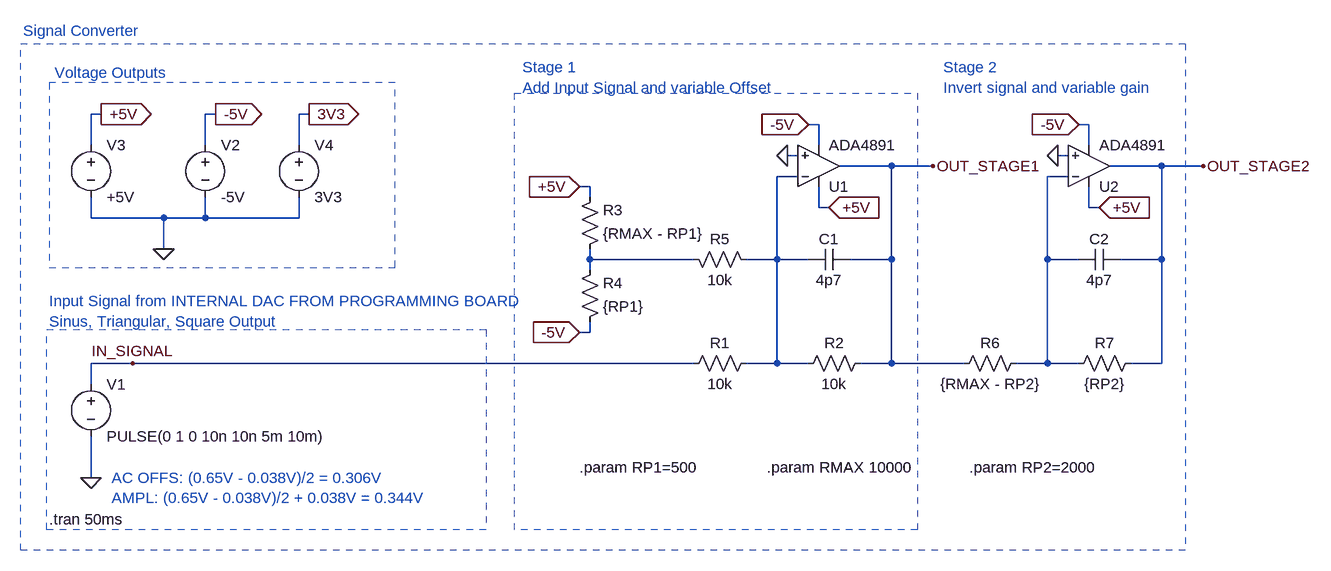
[diagram p0: schematic signal_converter_final2.asc]
signal_converter_final2.asc, the LTspice schematic file:
Version 4
SHEET 1 2372 984
WIRE 32 -320 16 -320
WIRE 208 -320 192 -320
WIRE 352 -320 336 -320
WIRE 1136 -304 1120 -304
WIRE 1552 -304 1536 -304
WIRE 16 -272 16 -320
WIRE 192 -272 192 -320
WIRE 336 -272 336 -320
WIRE 1136 -272 1136 -304
WIRE 1552 -272 1552 -304
WIRE 1104 -256 1088 -256
WIRE 1520 -256 1504 -256
WIRE 1248 -240 1168 -240
WIRE 1312 -240 1248 -240
WIRE 1664 -240 1584 -240
WIRE 1728 -240 1664 -240
WIRE 1104 -224 1072 -224
WIRE 1520 -224 1488 -224
WIRE 784 -208 768 -208
WIRE 784 -192 784 -208
WIRE 1136 -176 1136 -208
WIRE 1152 -176 1136 -176
WIRE 1552 -176 1552 -208
WIRE 1568 -176 1552 -176
WIRE 16 -160 16 -192
WIRE 128 -160 16 -160
WIRE 192 -160 192 -192
WIRE 192 -160 128 -160
WIRE 336 -160 336 -192
WIRE 336 -160 192 -160
WIRE 128 -112 128 -160
WIRE 784 -96 784 -112
WIRE 944 -96 784 -96
WIRE 1072 -96 1072 -224
WIRE 1072 -96 1024 -96
WIRE 1120 -96 1072 -96
WIRE 1248 -96 1248 -240
WIRE 1248 -96 1184 -96
WIRE 1488 -96 1488 -224
WIRE 1536 -96 1488 -96
WIRE 1664 -96 1664 -240
WIRE 1664 -96 1600 -96
WIRE 784 -80 784 -96
WIRE 784 16 784 0
WIRE 784 16 768 16
WIRE 80 64 16 64
WIRE 944 64 80 64
WIRE 1072 64 1072 -96
WIRE 1072 64 1024 64
WIRE 1120 64 1072 64
WIRE 1248 64 1248 -96
WIRE 1248 64 1200 64
WIRE 1360 64 1248 64
WIRE 1488 64 1488 -96
WIRE 1488 64 1440 64
WIRE 1536 64 1488 64
WIRE 1664 64 1664 -96
WIRE 1664 64 1616 64
WIRE 16 96 16 64
WIRE 16 240 16 176
FLAG 16 240 0
FLAG 128 -112 0
FLAG 32 -320 +5V
IOPIN 32 -320 Out
FLAG 208 -320 -5V
IOPIN 208 -320 Out
FLAG 352 -320 3V3
IOPIN 352 -320 Out
FLAG 80 64 IN_SIGNAL
FLAG 1152 -176 +5V
IOPIN 1152 -176 In
FLAG 1120 -304 -5V
IOPIN 1120 -304 In
FLAG 1312 -240 OUT_STAGE1
FLAG 768 -208 +5V
IOPIN 768 -208 In
FLAG 1568 -176 +5V
IOPIN 1568 -176 In
FLAG 1536 -304 -5V
IOPIN 1536 -304 In
FLAG 768 16 -5V
IOPIN 768 16 In
FLAG 1728 -240 OUT_STAGE2
FLAG 1088 -256 0
FLAG 1504 -256 0
SYMBOL voltage 16 80 R0
WINDOW 123 0 0 Left 2
WINDOW 39 0 0 Left 2
SYMATTR InstName V1
SYMATTR Value PULSE(0 1 0 10n 10n 5m 10m)
SYMBOL voltage 192 -288 R0
WINDOW 123 0 0 Left 2
WINDOW 39 0 0 Left 2
SYMATTR InstName V2
SYMATTR Value -5V
SYMBOL voltage 16 -288 R0
WINDOW 123 0 0 Left 2
WINDOW 39 0 0 Left 2
SYMATTR InstName V3
SYMATTR Value +5V
SYMBOL voltage 336 -288 R0
WINDOW 123 0 0 Left 2
WINDOW 39 0 0 Left 2
SYMATTR InstName V4
SYMATTR Value 3V3
SYMBOL res 1520 80 R270
WINDOW 3 0 56 VBottom 2
WINDOW 0 32 56 VTop 2
SYMATTR Value {RP2}
SYMATTR InstName R7
SYMBOL ADA4891 1136 -176 M180
SYMATTR InstName U1
SYMBOL /res 1456 48 R90
WINDOW 0 0 56 VBottom 2
WINDOW 3 32 56 VTop 2
SYMATTR InstName R6
SYMATTR Value {RMAX - RP2}
SYMBOL res 768 -96 M180
WINDOW 0 36 76 Left 2
WINDOW 3 36 40 Left 2
SYMATTR InstName R3
SYMATTR Value {RMAX - RP1}
SYMBOL res 768 16 M180
WINDOW 0 36 76 Left 2
WINDOW 3 36 40 Left 2
SYMATTR InstName R4
SYMATTR Value {RP1}
SYMBOL ADA4891 1552 -176 M180
SYMATTR InstName U2
SYMBOL res 1040 48 R90
WINDOW 0 0 56 VBottom 2
WINDOW 3 32 56 VTop 2
SYMATTR InstName R1
SYMATTR Value 10k
SYMBOL res 1040 -80 M270
WINDOW 0 32 56 VTop 2
WINDOW 3 0 56 VBottom 2
SYMATTR InstName R5
SYMATTR Value 10k
SYMBOL res 1216 48 R90
WINDOW 0 0 56 VBottom 2
WINDOW 3 32 56 VTop 2
SYMATTR InstName R2
SYMATTR Value 10k
SYMBOL cap 1600 -112 R90
WINDOW 0 0 32 VBottom 2
WINDOW 3 32 32 VTop 2
SYMATTR InstName C2
SYMATTR Value 4p7
SYMBOL cap 1184 -112 R90
WINDOW 0 0 32 VBottom 2
WINDOW 3 32 32 VTop 2
SYMATTR InstName C1
SYMATTR Value 4p7
TEXT -48 304 Left 2 !.tran 50ms
TEXT 48 240 Left 2 ;AC OFFS: (0.65V - 0.038V)/2 = 0.306V\nAMPL: (0.65V - 0.038V)/2 + 0.038V = 0.344V
TEXT -40 -384 Left 2 ;Voltage Outputs
TEXT -48 -32 Left 2 ;Input Signal from INTERNAL DAC FROM PROGRAMMING BOARD\nSinus, Triangular, Square Output
TEXT 680 -392 Left 2 ;Stage 1\nAdd Input Signal and variable Offset
TEXT 1368 224 Left 2 !.param RP2=2000
TEXT 768 224 Left 2 !.param RP1=500
TEXT -88 -448 Left 2 ;Signal Converter
TEXT 1056 224 Left 2 !.param RMAX 10000
TEXT 1328 -392 Left 2 ;Stage 2\nInvert signal and variable gain
RECTANGLE Normal 484 -368 -48 -84 1
RECTANGLE Normal -52 12 624 320 1
RECTANGLE Normal 668 -352 1288 320 1
RECTANGLE Normal -92 -428 1700 352 1

The netlist it stands for:
* signal_converter_final2.asc
V1 IN_SIGNAL 0 PULSE(0 1 0 10n 10n 5m 10m)
V2 -5V 0 -5V
V3 +5V 0 +5V
V4 3V3 0 3V3
R7 N002 OUT_STAGE2 {RP2}
XU1 0 N001 +5V -5V OUT_STAGE1 ADA4891-1  ; pins In+ In- V+ V- OUT
R6 N002 OUT_STAGE1 {RMAX - RP2}
R3 N003 +5V {RMAX - RP1}
R4 -5V N003 {RP1}
XU2 0 N002 +5V -5V OUT_STAGE2 ADA4891-1  ; pins In+ In- V+ V- OUT
R1 N001 IN_SIGNAL 10k
R5 N001 N003 10k
R2 OUT_STAGE1 N001 10k
C2 OUT_STAGE2 N002 4p7
C1 OUT_STAGE1 N001 4p7
.tran 50ms
* AC OFFS: (0.65V - 0.038V)/2 = 0.306V
* AMPL: (0.65V - 0.038V)/2 + 0.038V = 0.344V
* Voltage Outputs
* Input Signal from INTERNAL DAC FROM PROGRAMMING BOARD
* Sinus, Triangular, Square Output
* Stage 1
* Add Input Signal and variable Offset
.param RP2=2000
.param RP1=500
* Signal Converter
.param RMAX 10000
* Stage 2
* Invert signal and variable gain
.lib ADA4891-1.lib
.backanno
.end